# EAGLE design proto (EAGLE 8.1.0)
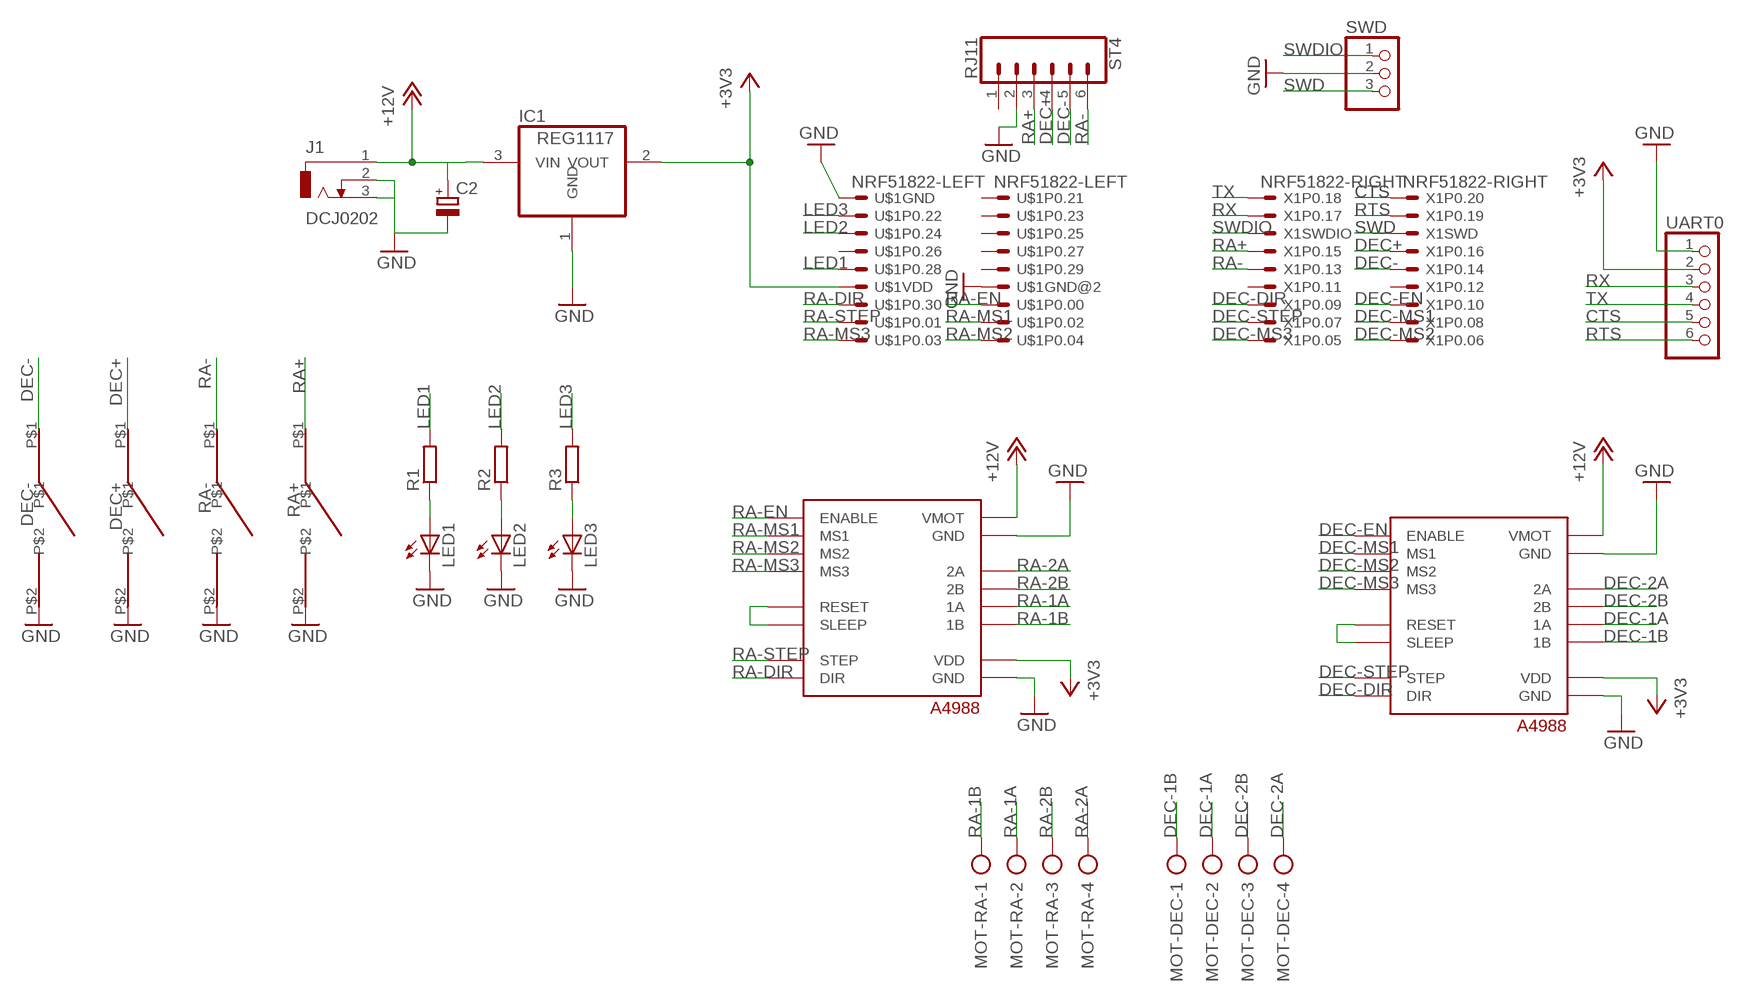
[diagram p0: schematic, sheet 1]

## Parts
C2  CPOL-EUSMCC  [SMC_C]
DEC+  TACT-SWITCH  [TACT-SWITCH-THT]
DEC-  TACT-SWITCH  [TACT-SWITCH-THT]
DRV-DEC  A4988_ALL  [A4988_ALL]
DRV-RA  A4988_ALL  [A4988_ALL]
IC1  REG1117  [SOT223]
J1  DCJ0202  [DCJ0202]
LED1  LEDSML1206  [SML1206]
LED2  LEDSML1206  [SML1206]
LED3  LEDSML1206  [SML1206]
MOT-DEC  AK500/4  [AK500/4]
MOT-RA  AK500/4  [AK500/4]
R1  RR1206  [R1206]
R2  RR1206  [R1206]
R3  RR1206  [R1206]
RA+  TACT-SWITCH  [TACT-SWITCH-THT]
RA-  TACT-SWITCH  [TACT-SWITCH-THT]
ST4  RJ11  RJ11-6  [RJ11-6]
SWD  PINHD-1X3  [1X03]
U$1  NRF51822-LEFT  [NRF51822-LEFT]
UART0  PINHD-1X6  [1X06]
X1  NRF51822-RIGHT  [NRF51822-RIGHT]

## Nets
+3V3: DRV-DEC.P15(VDD) DRV-RA.P15(VDD) IC1.2(VOUT) U$1.11 UART0.2
+12V: C2.+ DRV-DEC.P9(VMOT) DRV-RA.P9(VMOT) IC1.3(VIN) J1.1
CTS: UART0.5 X1.2
DEC+: DEC+.P$1 ST4.4 X1.8
DEC-: DEC-.P$1 ST4.5 X1.10
DEC-1A: DRV-DEC.P13(1A) MOT-DEC.2
DEC-1B: DRV-DEC.P14(1B) MOT-DEC.1
DEC-2A: DRV-DEC.P11(2A) MOT-DEC.4
DEC-2B: DRV-DEC.P12(2B) MOT-DEC.3
DEC-DIR: DRV-DEC.P8(DIR) X1.13
DEC-EN: DRV-DEC.P1(ENABLE) X1.14
DEC-MS1: DRV-DEC.P2(MS1) X1.16
DEC-MS2: DRV-DEC.P3(MS2) X1.18
DEC-MS3: DRV-DEC.P4(MS3) X1.17
DEC-STEP: DRV-DEC.P7(STEP) X1.15
GND: C2.- DEC+.P$2 DEC-.P$2 DRV-DEC.P10(GND) DRV-DEC.P16(GND) DRV-RA.P10(GND) DRV-RA.P16(GND) IC1.1(GND) J1.2 J1.3 LED1.C LED2.C LED3.C RA+.P$2 RA-.P$2 ST4.2 SWD.2 U$1.1 U$1.12 UART0.1
LED1: R1.2 U$1.9
LED2: R2.2 U$1.5
LED3: R3.2 U$1.3
N$1: LED1.A R1.1
N$2: LED2.A R2.1
N$3: LED3.A R3.1
N$4: DRV-RA.P5(RESET) DRV-RA.P6(SLEEP)
N$5: DRV-DEC.P5(RESET) DRV-DEC.P6(SLEEP)
RA+: RA+.P$1 ST4.3 X1.7
RA-: RA-.P$1 ST4.6 X1.9
RA-1A: DRV-RA.P13(1A) MOT-RA.2
RA-1B: DRV-RA.P14(1B) MOT-RA.1
RA-2A: DRV-RA.P11(2A) MOT-RA.4
RA-2B: DRV-RA.P12(2B) MOT-RA.3
RA-DIR: DRV-RA.P8(DIR) U$1.13
RA-EN: DRV-RA.P1(ENABLE) U$1.14
RA-MS1: DRV-RA.P2(MS1) U$1.16
RA-MS2: DRV-RA.P3(MS2) U$1.18
RA-MS3: DRV-RA.P4(MS3) U$1.17
RA-STEP: DRV-RA.P7(STEP) U$1.15
RTS: UART0.6 X1.4
RX: UART0.3 X1.3
SWD: SWD.3 X1.6
SWDIO: SWD.1 X1.5
TX: UART0.4 X1.1
Unconnected: ST4.1 U$1.2 U$1.4 U$1.6 U$1.7 U$1.8 U$1.10 X1.11 X1.12

## Library data of the parts
C2 = rcl:CPOL-EU: POLARIZED CAPACITOR, European symbol
DEC+ DEC- RA+ RA- = eq-custom2:TACT-SWITCH
DRV-DEC DRV-RA = A4988:A4988_ALL
IC1 = burr-brown:REG1117: 800mA and 1A Low Dropout (LDO) Positive Regulator 1.8V, 2.5V, 2.85V, 3.3V, 5V, and Adj; MPN: REG1117; OC_FARNELL: 1097566; OC_NEWARK: 14P6981
J1 = con-jack:DCJ0202: DC POWER JACK Source: DCJ0202.pdf; OC_FARNELL: unknown; OC_NEWARK: unknown
LED1-LED3 = led:LED: LED OSRAM: - CHIPLED LG R971, LG N971, LY N971, LG Q971, LY Q971, LO R971, LY R971 LH N974, LH R974 LS Q976, LO Q976, LY Q976 LO Q996 - Hyper CHIPLED LW Q18S LB Q993, LB Q99A, LB R99A - SideLED LS A670, LO A670, LY A670, LG A670, LP A670 LB A673, LV A673, LT A673, LW A673 LH A674 LY A675 LS A676, LA A676, LO A676, LY A676, LW A676 LS A679, LY A679, LG A679 - Hyper Micro SIDELED® LS Y876, LA Y876, LO Y876, LY Y876 LT Y87S - SmartLED LW L88C, LW L88S LB L89C, LB L89S, LG L890 LS L89K, LO L89K, LY L89K LS L896, LA L896, LO L896, LY L896 - TOPLED LS T670, LO T670, LY T670, LG T670, LP T670 LSG T670, LSP T670, LSY T670, LOP T670, LYG T670 LG T671, LOG T671, LSG T671 LB T673, LV T673, LT T673, LW T673 LH T674 LS T676, LA T676, LO T676, LY T676, LB T676, LH T676, LSB T676, LW T676 LB T67C, LV T67C, LT T67C, LS T67K, LO T67K, LY T67K, LW E67C LS E67B, LA E67B, LO E67B, LY E67B, LB E67C, LV E67C, LT E67C LW T67C LS T679, LY T679, LG T679 LS T770, LO T770, LY T770, LG T770, LP T770 LB T773, LV T773, LT T773, LW T773 LH T774 LS E675, LA E675, LY E675, LS T675 LS T776, LA T776, LO T776, LY T776, LB T776 LHGB T686 LT T68C, LB T68C - Hyper Mini TOPLED® LB M676 - Mini TOPLED Santana® LG M470 LS M47K, LO M47K, LY M47K Source: http://www.osram.convergy.de LUXEON: - LUMILED® LXK2-PW12-R00, LXK2-PW12-S00, LXK2-PW14-U00, LXK2-PW14-V00 LXK2-PM12-R00, LXK2-PM12-S00, LXK2-PM14-U00 LXK2-PE12-Q00, LXK2-PE12-R00, LXK2-PE12-S00, LXK2-PE14-T00, LXK2-PE14-U00 LXK2-PB12-K00, LXK2-PB12-L00, LXK2-PB12-M00, LXK2-PB14-N00, LXK2-PB14-P00, LXK2-PB14-Q00 LXK2-PR12-L00, LXK2-PR12-M00, LXK2-PR14-Q00, LXK2-PR14-R00 LXK2-PD12-Q00, LXK2-PD12-R00, LXK2-PD12-S00 LXK2-PH12-R00, LXK2-PH12-S00 LXK2-PL12-P00, LXK2-PL12-Q00, LXK2-PL12-R00 Source: www.luxeon.com KINGBRIGHT: KA-3528ASYC Source: www.kingbright.com
MOT-DEC MOT-RA = con-ptr500:AK500/4: CONNECTOR; OC_FARNELL: unknown; OC_NEWARK: unknown
R1-R3 = eagle-ltspice:R: RESISTOR, European symbol; SPICEMODEL: NONE; SPICEPREFIX: R
ST4 = SparkFun-Connectors:RJ11-6: RJ11 Jack - 6 pin Commonly found on CAT3 devices and some Microchip programmers. Here is the connector we sell at SparkFun: RJ11 6-Pin Connector <https://www.sparkfun.com/products/132> (PRT-00132) Datasheet <http://www.sparkfun.com/datasheets/Prototyping/Connectors/RJ11-Datasheet.pdf> It is used on this SparkFun product: SparkFun Weather Shield <https://www.sparkfun.com/products/12081> (DEV-12081) Weather Meters <https://www.sparkfun.com/products/8942> (SEN-08942); PROD_ID: CONN-08590; SF_ID: PRT-00132
SWD = pinhead:PINHD-1X3: PIN HEADER
U$1 = icarus_sensors:NRF51822-LEFT: left connector of NFR518822 board; MPN: NRF51822-left; OC_FARNELL: unknown; OC_NEWARK: 25M5675
UART0 = pinhead:PINHD-1X6: PIN HEADER
X1 = icarus_sensors:NRF51822-RIGHT: right connector of NFR518822 board; MPN: NRF51822-right; OC_FARNELL: unknown; OC_NEWARK: 25M5675

## Board
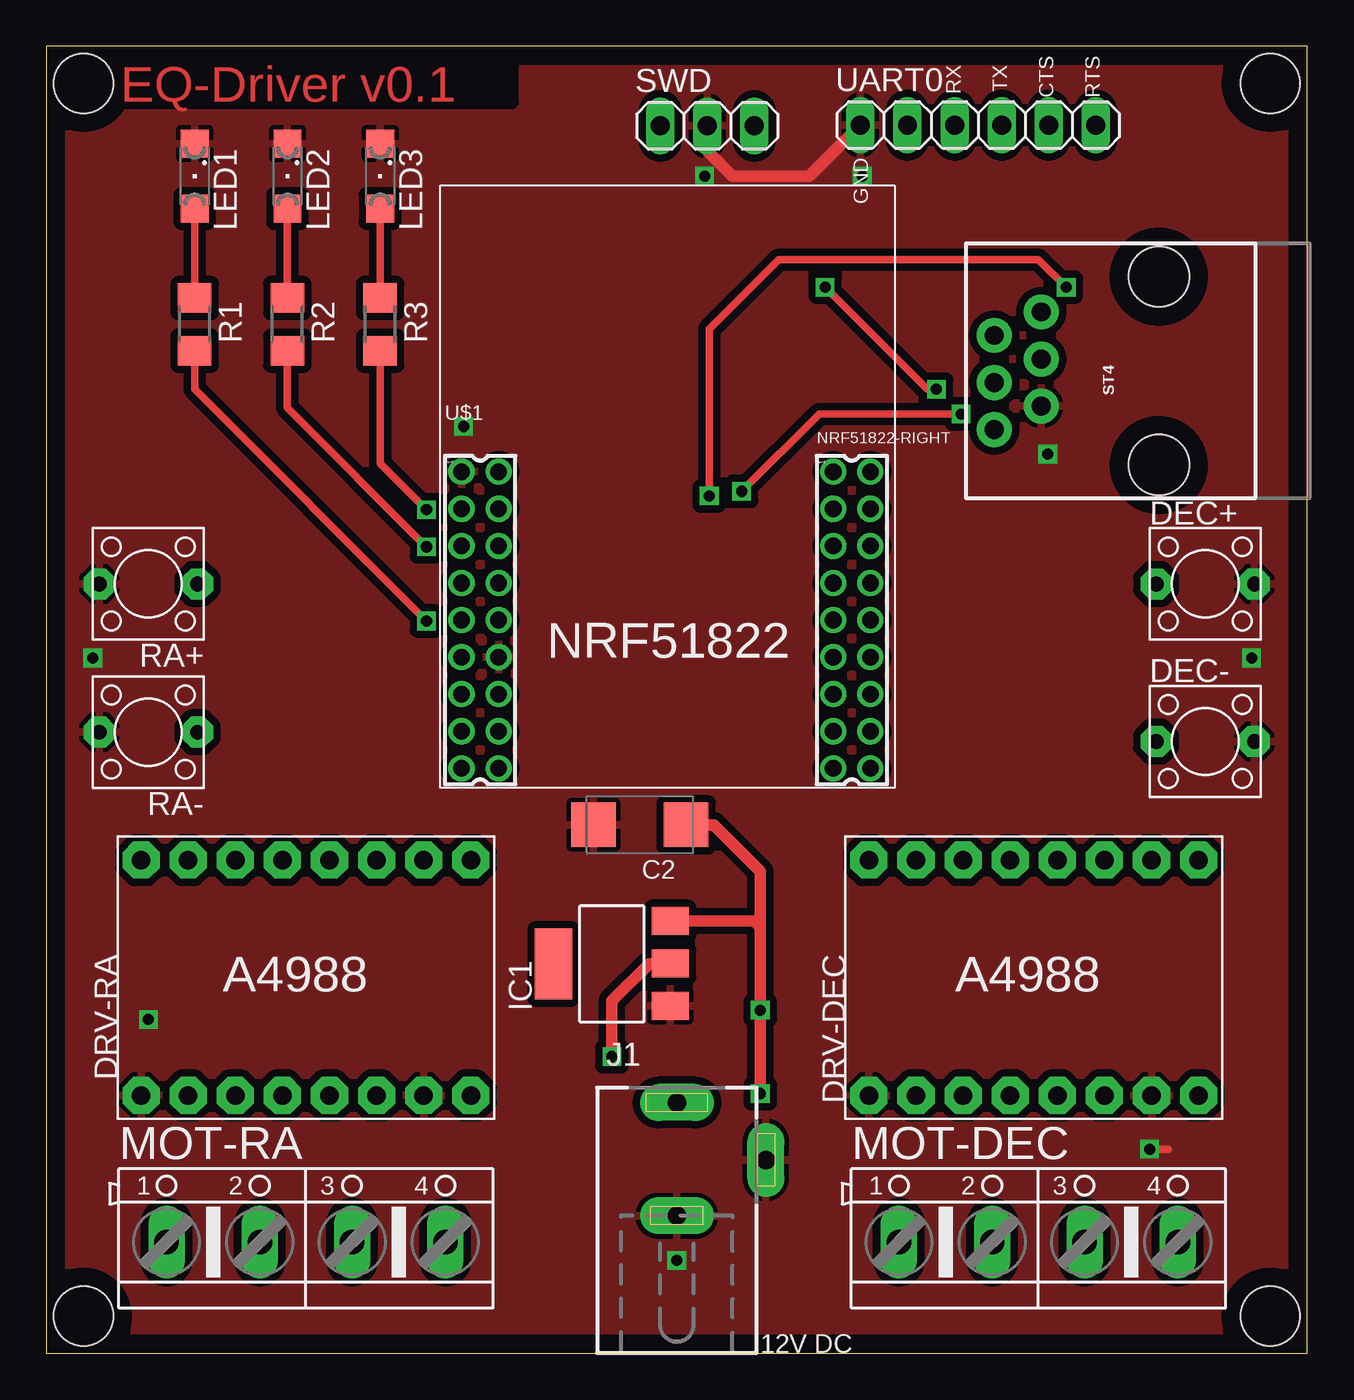
[diagram p1: board, top side]
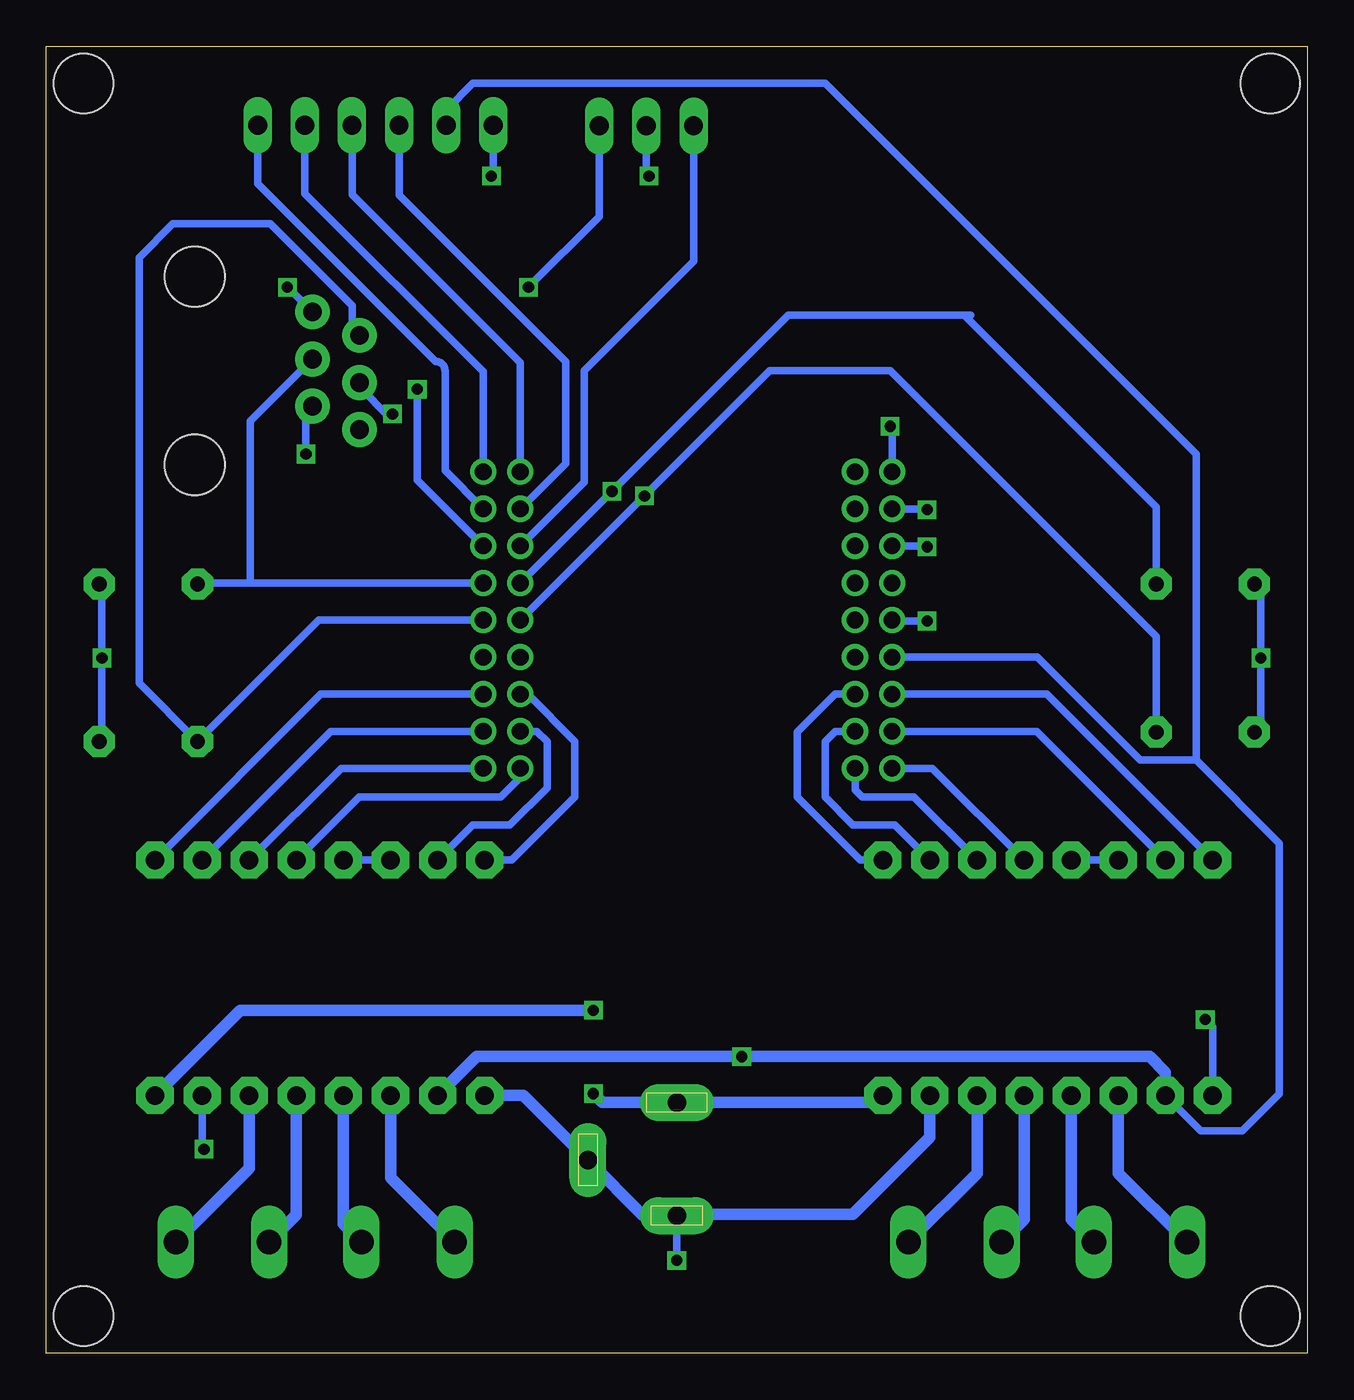
[diagram p2: board, bottom side, seen from below]

Size 68 x 70.5 mm. Coordinates in mm from the lower left corner, seen from the top.
Outline: 0,0 68,0 68,70.5 0,70.5 0,0
Copper layers (1*16): Top 0.035mm / dielectric 1.5mm / Bottom 0.035mm
Design rules "default": minimum track width 10mil, minimum drill 24mil, track to track 8mil, track to pad 8mil, pad to pad 8mil, via to via 8mil, smd to smd 8mil, copper to edge 40mil, drill to drill 8mil, minimum pad ring 10mil, minimum via ring 8mil, stop-mask expansion 4mil, vias tented up to drill 0mil, thermal gap 10mil
Holes 3.2 mm at 2,68.5 66,68.5 66,2 2,2

### Footprints (pad centres in the part's own frame; a part is rotated, then mirrored left to right if it is on the bottom)
SMC_C = smd 2.4 x 2.4: + -2.5,0; - 2.5,0
TACT-SWITCH-THT = drill 0.8 pad 1.676 octagon: P$1 -2.65,0; P$2 2.65,0
A4988_ALL = drill 1 pad 2 octagon: P1 -6.35,8.89; P2 -6.35,6.35; P3 -6.35,3.81; P4 -6.35,1.27; P5 -6.35,-1.27; P6 -6.35,-3.81; P7 -6.35,-6.35; P8 -6.35,-8.89; P9 6.35,8.89; P10 6.35,6.35; P11 6.35,3.81; P12 6.35,1.27; P13 6.35,-1.27; P14 6.35,-3.81; P15 6.35,-6.35; P16 6.35,-8.89
SOT223 = smd 1.499 x 2.007: 1 -2.261,-3.15; 2 0.025,-3.15; 3 2.311,-3.15 | smd 3.81 x 2.007: 4 0,3.15
DCJ0202 = drill 1 pad 2 long: 1 0,3.1; 2 4.8,0; 3 0,-3
SML1206 = smd 1.5 x 1.5: A 1.75,0; C -1.75,0
AK500/4 = drill 1.321 long: 1 -7.518,0; 2 -2.489,0; 3 2.489,0; 4 7.518,0
R1206 = smd 1.6 x 1.803: 1 -1.422,0; 2 1.422,0
RJ11-6 = drill 1.016 pad 1.88: 1 -3.175,8.89; 2 -1.905,6.35; 3 -0.635,8.89; 4 0.635,6.35; 5 1.905,8.89; 6 3.175,6.35 | hole 3.251: -5.08,0; 5.08,0
1X03 = drill 1.016 long: 1 -2.54,0; 2 0,0; 3 2.54,0
NRF51822-LEFT = drill 0.9 pad 1.27: 1 -8,-1; 2 -8,1; 3 -6,-1; 4 -6,1; 5 -4,-1; 6 -4,1; 7 -2,-1; 8 -2,1; 9 0,-1; 10 0,1; 11 2,-1; 12 2,1; 13 4,-1; 14 4,1; 15 6,-1; 16 6,1; 17 8,-1; 18 8,1
1X06 = drill 1.016 long: 1 -6.35,0; 2 -3.81,0; 3 -1.27,0; 4 1.27,0; 5 3.81,0; 6 6.35,0
NRF51822-RIGHT = drill 0.9 pad 1.27: 1 -8,-1; 2 -8,1; 3 -6,-1; 4 -6,1; 5 -4,-1; 6 -4,1; 7 -2,-1; 8 -2,1; 9 0,-1; 10 0,1; 11 2,-1; 12 2,1; 13 4,-1; 14 4,1; 15 6,-1; 16 6,1; 17 8,-1; 18 8,1

### Placement (x,y rotation side)
C2  32,28.5 180 top
DEC+  62.5,41.5 0 top
DEC-  62.5,33 0 top
DRV-DEC  53.25,20.25 270 top
DRV-RA  14,20.25 270 top
IC1  30.5,21 90 top
J1  34,10.42 0 top
LED1  8,63.5 270 top
LED2  13,63.5 270 top
LED3  18,63.5 270 top
MOT-DEC  53.5,6 0 top
MOT-RA  14,6 0 top
R1  8,55.5 270 top
R2  13,55.5 270 top
R3  18,55.5 270 top
RA+  5.5,41.5 180 top
RA-  5.5,33.5 180 top
ST4  60,53 90 top
SWD  35.64,66.21 0 top
U$1  23.39,39.55 270 top
UART0  50.25,66.25 0 top
X1  43.44,39.55 270 top

### Tracks (layer width: path | path; a pad name or v marks a point on that pad's centre or on a via)
+3V3  (via drill 0.6)
  Top 0.61: v30.5,16 30.5,19 32.5,21 33.62,21 IC1.2
  Bottom 0.406: DRV-RA.P15 5.75,12 3.5,12 1.5,14 1.5,27.5 6,32 | UART0.2 46.44,67.06 45,68.5 32,68.5 31,68.5 26,68.5 6,48.5 6,32 | 6,32 9,32 14.55,37.55 U$1.11
  Bottom 0.61: DRV-RA.P15 7.65,15.15 8.5,16 v30.5,16 44.8,16 DRV-DEC.P15
+12V  (via drill 0.6)
  Top 0.61: 33.84,23.5 IC1.3 38.19,23.31 38.5,23 | v38.5,14 v38.5,18.5 38.5,23 | 38.5,23 38.5,26 36,28.5 C2.+
  Bottom 0.61: DRV-RA.P9 23.27,13.52 J1.1 38.02,13.52 v38.5,14 | v38.5,18.5 57.54,18.5 DRV-DEC.P9
CTS
  Bottom 0.406: 54,66.19 UART0.5 54.06,62.56 44.44,52.94 X1.2
DEC+
  Bottom 0.406: DEC+.P$1 59.8,41.55 57,41.55 | 57,41.55 X1.8 | ST4.4 57,50.28 57,41.55
DEC-
  Bottom 0.406: 44.44,39.79 X1.10 53.3,39.55 DEC-.P$1 63,36.15 63,59.1 61.18,60.92 55.92,60.92 51.5,56.5 51.5,54.91 ST4.5
DEC-1A
  Bottom 0.61: DRV-DEC.P13 51.98,6.97 MOT-DEC.2
DEC-1B
  Bottom 0.61: DRV-DEC.P14 49.44,9.46 MOT-DEC.1
DEC-2A
  Bottom 0.61: DRV-DEC.P11 57.06,9.96 MOT-DEC.4
DEC-2B
  Bottom 0.61: DRV-DEC.P12 54.52,7.47 MOT-DEC.3
DEC-DIR
  Bottom 0.406: DRV-DEC.P8 42.9,26.6 39.5,30 39.5,33 42.05,35.55 X1.13
DEC-EN
  Bottom 0.406: DRV-DEC.P1 53.19,35.55 X1.14
DEC-MS1
  Bottom 0.406: DRV-DEC.P2 52.65,33.55 X1.16
DEC-MS2
  Bottom 0.406: DRV-DEC.P3 52.11,31.55 X1.18
DEC-MS3
  Bottom 0.406: DRV-DEC.P4 51.12,30 43.5,30 42.44,31.06 X1.17
DEC-STEP
  Bottom 0.406: DRV-DEC.P7 45,28.5 43,28.5 41,30.5 41,33 41.55,33.55 X1.15
GND  (via drill 0.6)
  Top 0.406: LED2.C 13,65 | v59.5,11 60.5,11
  Top 0.61: SWD.2 35.64,64.86 37,63.5 41.15,63.5 UART0.1
  Bottom 0.406: DRV-DEC.P10 59.6,11.1 v59.5,11 | DRV-RA.P16 5.11,17.61 v5.5,18 | U$1.1 22.39,49.89 v22.5,50 | UART0.1 43.9,63.6 v44,63.5 | SWD.2 35.64,63.64 v35.5,63.5 | v34,5 J1.3 | RA+.P$2 2.5,41.15 v2.5,37.5 2.5,33.85 RA-.P$2 | DEC-.P$2 65,33.15 v65,37.5 65,41.35 DEC+.P$2 | ST4.2 54,50.74 v54,48.5
  Bottom 0.61: DRV-RA.P10 20.35,11.65 24.5,7.5 33.92,7.5 J1.3 35.8,7.42 J1.2 42.28,13.9 DRV-DEC.P16
  pour Top (isolate 0.406): 0.5,70 67.5,70 67.5,0.5 0.5,0.5
LED1  (via drill 0.6)
  Top 0.406: R1.2 8,52 v20.5,39.5
  Bottom 0.406: 22.34,39.5 U$1.9 22.34,39.5 | v20.5,39.5 22.34,39.5
LED2  (via drill 0.6)
  Top 0.406: v20.5,43.5 13,51 R2.2
  Bottom 0.406: U$1.5 20.55,43.55 v20.5,43.5
LED3  (via drill 0.6)
  Top 0.406: R3.2 18,48 v20.5,45.5
  Bottom 0.406: v20.5,45.5 20.5,45.55 U$1.3
N$1
  Top 0.406: LED1.A R1.1
N$2
  Top 0.406: LED2.A R2.1
N$3
  Top 0.406: LED3.A R3.1
N$4
  Bottom 0.406: DRV-RA.P6 DRV-RA.P5
N$5
  Bottom 0.406: DRV-DEC.P6 DRV-DEC.P5
RA+  (via drill 0.6)
  Top 0.406: v49.33,50.67 41.67,50.67 v37.49,46.49
  Bottom 0.406: X1.7 v37.49,46.49 27.99,56 18.5,56 | 18.5,56 18.15,56 | RA+.P$1 8.15,45.65 18.5,56 | ST4.3 51.11,52.11 49.5,50.5 v49.33,50.67
RA-  (via drill 0.6)
  Top 0.406: v55,57.5 53.5,59 39.5,59 35.74,55.24 v35.74,46.24
  Bottom 0.406: X1.9 v35.74,46.24 28.99,53 22.5,53 8.15,38.65 RA-.P$1 | ST4.6 54.97,57.5 v55,57.5
RA-1A
  Bottom 0.61: DRV-RA.P13 12.73,7.22 MOT-RA.2
RA-1B
  Bottom 0.61: DRV-RA.P14 10.19,9.71 MOT-RA.1
RA-2A
  Bottom 0.61: DRV-RA.P11 17.81,9.71 MOT-RA.4
RA-2B
  Bottom 0.61: DRV-RA.P12 15.27,7.22 MOT-RA.3
RA-DIR
  Bottom 0.406: DRV-RA.P8 14.06,35.55 U$1.13
RA-EN
  Bottom 0.406: U$1.14 25.45,35.55 27.5,33.5 27.5,30 24.1,26.6 DRV-RA.P1
RA-MS1
  Bottom 0.406: DRV-RA.P2 22.25,28.5 24.5,28.5 26,30 26,33 25.45,33.55 U$1.16
RA-MS2
  Bottom 0.406: DRV-RA.P3 21.21,30 24,30 24.39,30.39 U$1.18
RA-MS3
  Bottom 0.406: DRV-RA.P4 20.22,31.55 U$1.17
RA-STEP
  Bottom 0.406: DRV-RA.P7 14.6,33.55 U$1.15
RTS
  Top 0.406: 44.55,45.55 X1.4
  Bottom 0.406: X1.4 46.5,47.61 46.5,51 | 46.5,51 46.5,52.5 | UART0.6 56.6,63.1 47,53.5 arc90 46.5,53 46.5,51
RX
  Bottom 0.406: UART0.3 48.98,62.48 40,53.5 40,47.99 X1.3
SWD  (via drill 0.6)
  Top 0.406: v42,57.5 47.5,52 v48,52
  Bottom 0.406: SWD.3 38.18,62 | 38.18,62 38.18,61.82 | v48,52 48,47.11 X1.6 | 38.18,62 38.18,61.32 v42,57.5
SWDIO
  Bottom 0.406: X1.5 39,46.99 39,53 33.1,58.9 SWD.1
TX
  Bottom 0.406: X1.1 42.44,53.44 51.5,62.5 51.5,66.23 UART0.4

### Text on the board
Top: EQ-Driver v0.1
tNames: CTS | RTS | RX | TX | GND | NRF51822 | A4988 | A4988 | 12V DC